# EAGLE design Serial I2C Bridge (EAGLE 6.1)
DATABASE: ./../../../eagle/PARTSDB.TXT
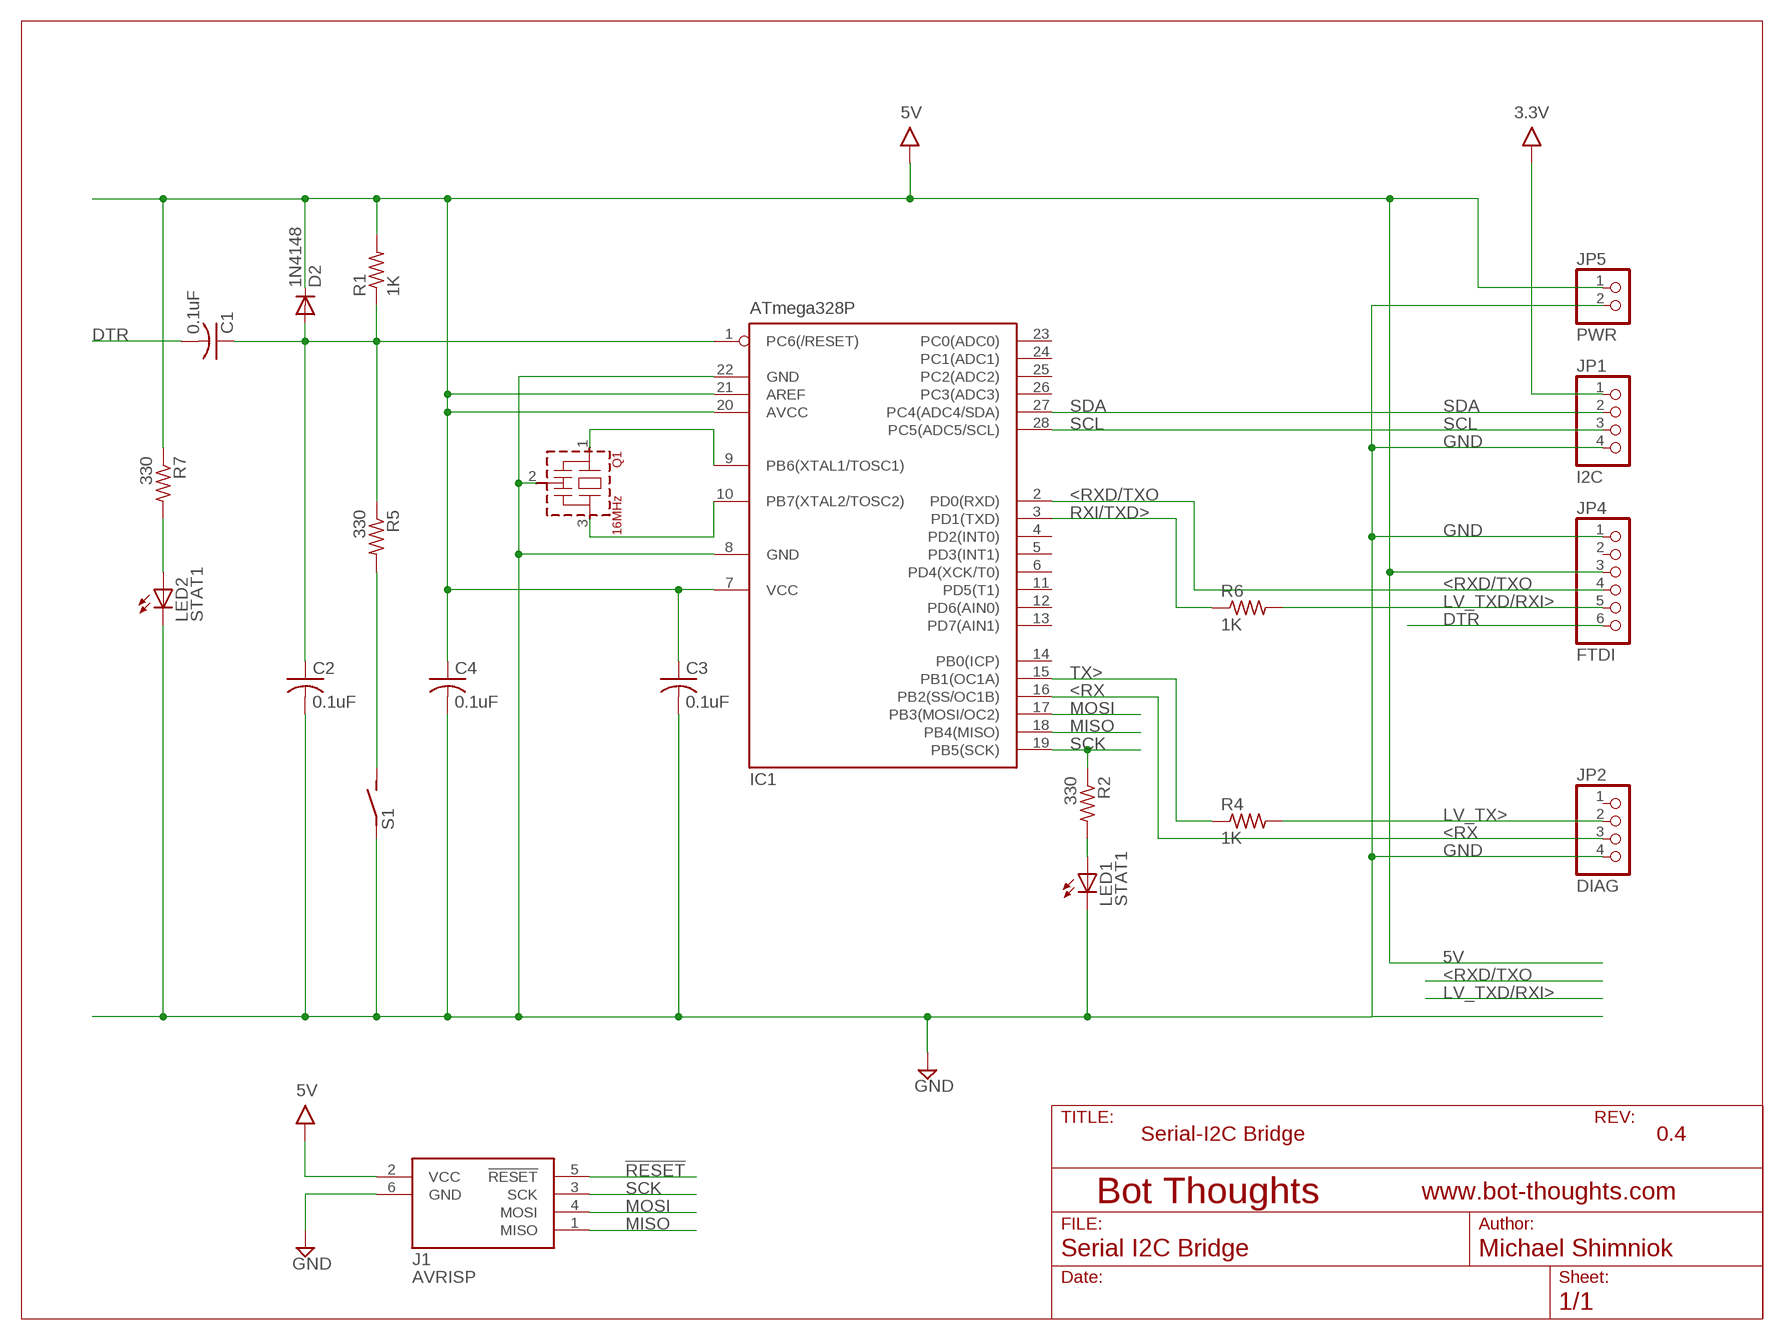
[diagram p0: schematic, sheet 1]

## Parts
C1  0.1uF  C-USC0805  [C0805]
C2  0.1uF  C-USC0805  [C0805]
C3  0.1uF  C-USC0805  [C0805]
C4  0.1uF  C-USC0805  [C0805]
D2  1N4148  1N4148DO35-7  [DO35-7]
IC1  ATmega328P  MEGA8-P  [DIL28-3]
J1  AVRISP  AVRISP6  [CON6P2R]
JP1  I2C  PINHD-1X04_2.54-S  [1X04-S]
JP2  DIAG  PINHD-1X04_2.54-S  [1X04-S]
JP4  FTDI  PINHD-1X06_2.54-S  [1X06-S]
JP5  PWR  PINHD-1X02_2.54-S  [1X02-S]
LED1  STAT1  LED3MM  [LED3MM]
LED2  STAT1  LED3MM  [LED3MM]
Q1  16MHz  CSTLS_G*  [CSTLS_G9]
R1  1K  R-US_0204/5  [0204/5]
R2  330  R-US_0204/5  [0204/5]
R4  1K  R-US_0204/5  [0204/5]
R5  330  R-US_0204/5  [0204/5]
R6  1K  R-US_0204/5  [0204/5]
R7  330  R-US_0204/5  [0204/5]
S1  RESET\  SPST2EVQ11X09  [EVQ11X09]

## Nets
3.3V: JP1.1
5V: C3.1 C4.1 D2.C IC1.7(VCC) IC1.20(AVCC) IC1.21(AREF) J1.2(VCC) JP4.3 JP5.1 R1.2 R7.1
!RESET: C1.1 C2.1 D2.A IC1.1(PC6(/RESET)) J1.5(!RESET) R1.1 R5.1
<RX: IC1.16(PB2(SS/OC1B)) JP2.3
<RXD/TXO: IC1.2(PD0(RXD)) JP4.4
DTR: C1.2 JP4.6
GND: C2.2 C3.2 C4.2 IC1.8(GND) IC1.22(GND) J1.6(GND) JP1.4 JP2.4 JP4.1 JP5.2 LED1.K(C) LED2.K(C) Q1.2(VSS) S1.1
LV_TX>: JP2.2 R4.2
LV_TXD/RXI>: JP4.5 R6.2
MISO: IC1.18(PB4(MISO)) J1.1(MISO)
MOSI: IC1.17(PB3(MOSI/OC2)) J1.4(MOSI)
N$2: IC1.9(PB6(XTAL1/TOSC1)) Q1.1
N$3: IC1.10(PB7(XTAL2/TOSC2)) Q1.3
N$4: LED1.A R2.2
N$7: R5.2 S1.2
N$8: LED2.A R7.2
RXI/TXD>: IC1.3(PD1(TXD)) R6.1
SCK: IC1.19(PB5(SCK)) J1.3(SCK) R2.1
SCL: IC1.28(PC5(ADC5/SCL)) JP1.3
SDA: IC1.27(PC4(ADC4/SDA)) JP1.2
TX>: IC1.15(PB1(OC1A)) R4.1
Unconnected: IC1.4(PD2(INT0)) IC1.5(PD3(INT1)) IC1.6(PD4(XCK/T0)) IC1.11(PD5(T1)) IC1.12(PD6(AIN0)) IC1.13(PD7(AIN1)) IC1.14(PB0(ICP)) IC1.23(PC0(ADC0)) IC1.24(PC1(ADC1)) IC1.25(PC2(ADC2)) IC1.26(PC3(ADC3)) JP2.1 JP4.2

## Notes on the sheet
- Serial-I2C Bridge | 0.4

## Library data of the parts
C1 = rcl:C-US: CAPACITOR, American symbol; PARTNO: CC0603ZRY5V7BB104
C2-C4 = rcl:C-US: CAPACITOR, American symbol; PARTNO: C1608X5R0J105K
D2 = diode:1N4148: DIODE high speed (Philips)
IC1 = atmel:MEGA8-P: MICROCONTROLLER 8 Kbytes FLASH, 1 kbytes SRAM, 512 bytes EEPROM, USART, 4-channel 10 bit ADC, 2-channel 8 bit ADC Pin compatible with Atmega48, ATMega88, ATMega168 Source: avr.lbr; OC_FARNELL: unknown; OC_NEWARK: unknown; PARTNO: DEV-10524
J1 = ads4:AVRISP6: 6-pin dual-row connector for Atmel AVRISP programmer interface
JP1 JP2 = pinhead-2:PINHD-1X04: PIN HEADER; PARTNO: 2211S-04G
JP4 = pinhead-2:PINHD-1X06: PIN HEADER; PARTNO: 2211S-06G
JP5 = pinhead-2:PINHD-1X02: PIN HEADER
LED1 LED2 = led:LED: LED OSRAM: - CHIPLED LG R971, LG N971, LY N971, LG Q971, LY Q971, LO R971, LY R971 LH N974, LH R974 LS Q976, LO Q976, LY Q976 LO Q996 - Hyper CHIPLED LW Q18S LB Q993, LB Q99A, LB R99A - SideLED LS A670, LO A670, LY A670, LG A670, LP A670 LB A673, LV A673, LT A673, LW A673 LH A674 LY A675 LS A676, LA A676, LO A676, LY A676, LW A676 LS A679, LY A679, LG A679 - Hyper Micro SIDELED® LS Y876, LA Y876, LO Y876, LY Y876 LT Y87S - SmartLED LW L88C, LW L88S LB L89C, LB L89S, LG L890 LS L89K, LO L89K, LY L89K LS L896, LA L896, LO L896, LY L896 - TOPLED LS T670, LO T670, LY T670, LG T670, LP T670 LSG T670, LSP T670, LSY T670, LOP T670, LYG T670 LG T671, LOG T671, LSG T671 LB T673, LV T673, LT T673, LW T673 LH T674 LS T676, LA T676, LO T676, LY T676, LB T676, LH T676, LSB T676, LW T676 LB T67C, LV T67C, LT T67C, LS T67K, LO T67K, LY T67K, LW E67C LS E67B, LA E67B, LO E67B, LY E67B, LB E67C, LV E67C, LT E67C LW T67C LS T679, LY T679, LG T679 LS T770, LO T770, LY T770, LG T770, LP T770 LB T773, LV T773, LT T773, LW T773 LH T774 LS E675, LA E675, LY E675, LS T675 LS T776, LA T776, LO T776, LY T776, LB T776 LHGB T686 LT T68C, LB T68C - Hyper Mini TOPLED® LB M676 - Mini TOPLED Santana® LG M470 LS M47K, LO M47K, LY M47K Source: http://www.osram.convergy.de LUXEON: - LUMILED® LXK2-PW12-R00, LXK2-PW12-S00, LXK2-PW14-U00, LXK2-PW14-V00 LXK2-PM12-R00, LXK2-PM12-S00, LXK2-PM14-U00 LXK2-PE12-Q00, LXK2-PE12-R00, LXK2-PE12-S00, LXK2-PE14-T00, LXK2-PE14-U00 LXK2-PB12-K00, LXK2-PB12-L00, LXK2-PB12-M00, LXK2-PB14-N00, LXK2-PB14-P00, LXK2-PB14-Q00 LXK2-PR12-L00, LXK2-PR12-M00, LXK2-PR14-Q00, LXK2-PR14-R00 LXK2-PD12-Q00, LXK2-PD12-R00, LXK2-PD12-S00 LXK2-PH12-R00, LXK2-PH12-S00 LXK2-PL12-P00, LXK2-PL12-Q00, LXK2-PL12-R00 Source: www.luxeon.com KINGBRIGHT: KA-3528ASYC Source: www.kingbright.com; BOM: EXCLUDE
Q1 = murata-resonators:CSTLS_G: Ceramic resonator 2.00 to 10.00 MHz; PARTNO: AWCR-16.00MD
R1 = rcl:R-US_: RESISTOR, American symbol; BOM: EXCLUDE
R2 R4-R7 = rcl:R-US_: RESISTOR, American symbol; PARTNO: CRCW0603330RJNEA
S1 = ads4:SPST2: SPST Switch; PARTNO: SALVAGE

## Board
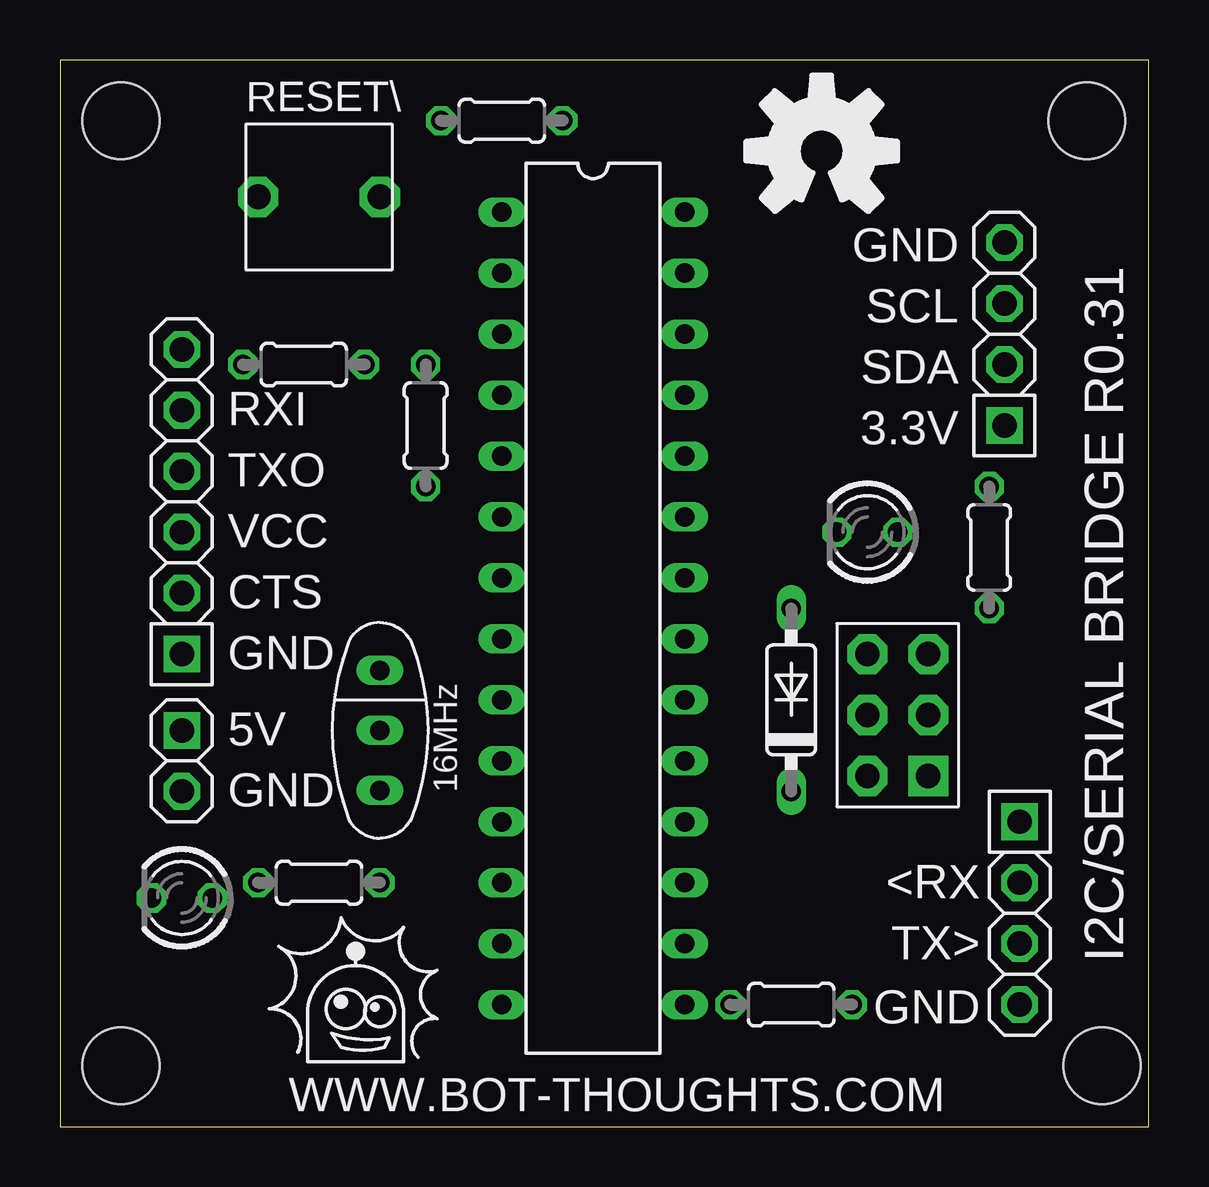
[diagram p1: board, top side]
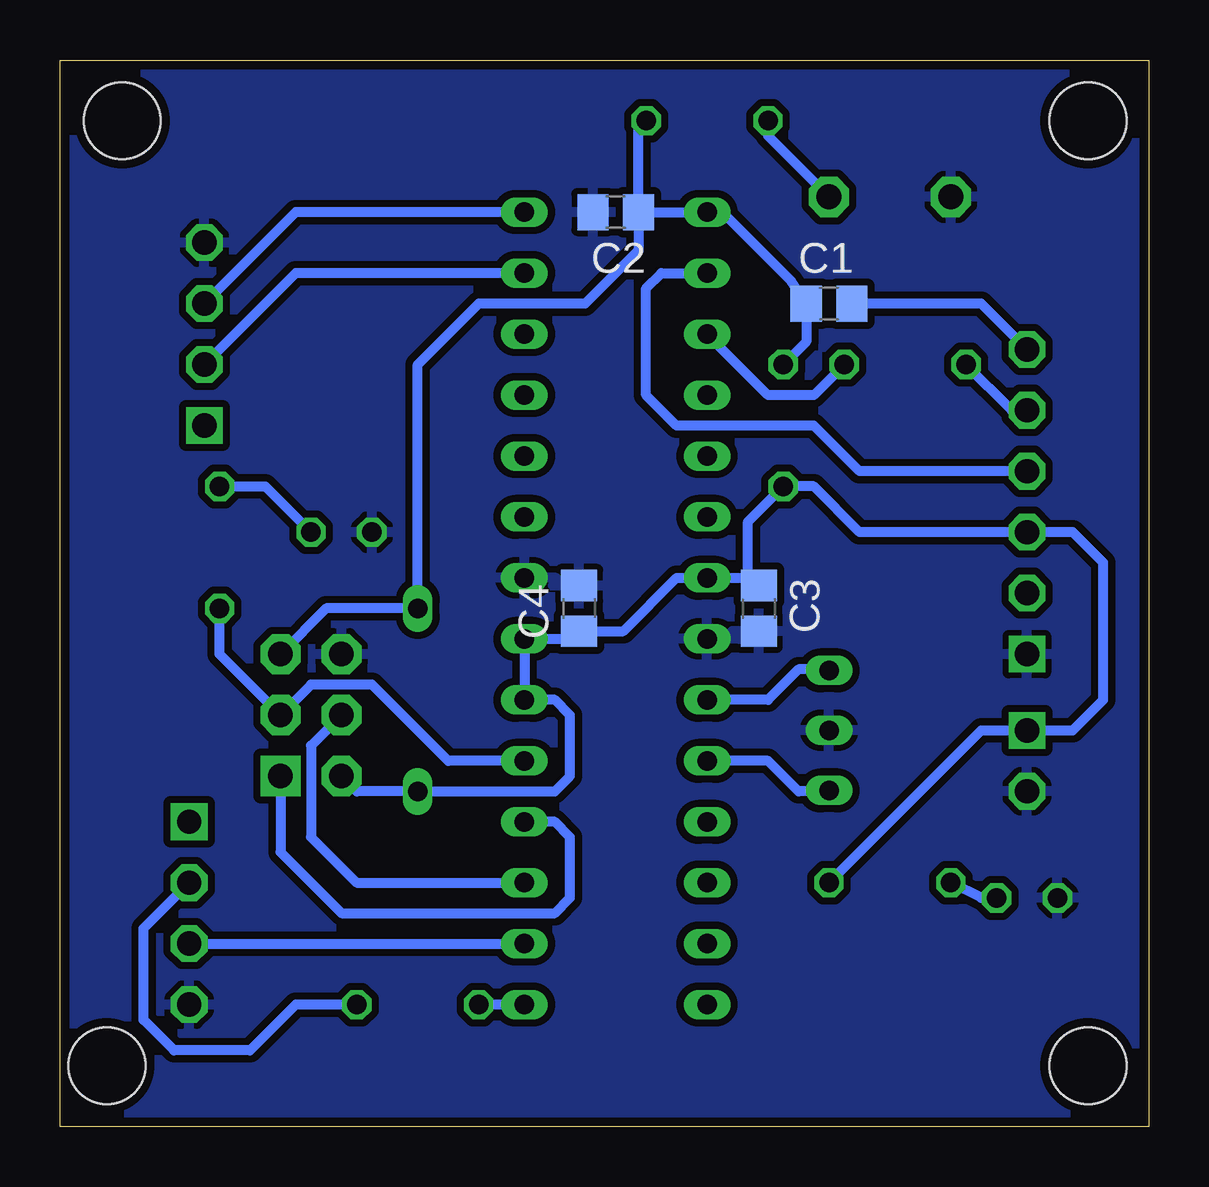
[diagram p2: board, bottom side, seen from below]

Size 45.39 x 44.44 mm. Coordinates in mm from the lower left corner, seen from the top.
Outline: 0,0 45.39,0 45.39,44.44 0,44.44 0,0
Copper layers (1*16): Top 0.0356mm / dielectric 1.5011mm / Bottom 0.0356mm
Design rules: minimum track width 6mil, minimum drill 13mil, track to track 6mil, track to pad 6mil, pad to pad 6mil, via to via 6mil, smd to smd 6mil, copper to edge 15mil, drill to drill 6mil, minimum pad ring 7mil, minimum via ring 7mil, stop-mask expansion 4mil, vias tented up to drill 0mil, thermal gap 10mil
Holes 3.2 mm at 2.54,41.91 42.8,41.91 43.43,2.54 2.54,2.54

### Footprints (pad centres in the part's own frame; a part is rotated, then mirrored left to right if it is on the bottom)
C0805 = smd 1.3 x 1.5: 1 -0.95,0; 2 0.95,0
DO35-7 = drill 0.813 long: A 3.81,0; C -3.81,0
DIL28-3 = drill 0.813 long: 1 -16.51,-3.81; 2 -13.97,-3.81; 3 -11.43,-3.81; 4 -8.89,-3.81; 5 -6.35,-3.81; 6 -3.81,-3.81; 7 -1.27,-3.81; 8 1.27,-3.81; 9 3.81,-3.81; 10 6.35,-3.81; 11 8.89,-3.81; 12 11.43,-3.81; 13 13.97,-3.81; 14 16.51,-3.81; 15 16.51,3.81; 16 13.97,3.81; 17 11.43,3.81; 18 8.89,3.81; 19 6.35,3.81; 20 3.81,3.81; 21 1.27,3.81; 22 -1.27,3.81; 23 -3.81,3.81; 24 -6.35,3.81; 25 -8.89,3.81; 26 -11.43,3.81; 27 -13.97,3.81; 28 -16.51,3.81
CON6P2R = drill 1.016 pad 1.676 square: 1 -2.54,-1.27 | drill 1.016 pad 1.676 octagon: 2 -2.54,1.27; 3 0,-1.27; 4 0,1.27; 5 2.54,-1.27; 6 2.54,1.27
1X04-S = drill 1.016 square: 1 -3.81,0 | drill 1.016 octagon: 2 -1.27,0; 3 1.27,0; 4 3.81,0
1X06-S = drill 1.016 square: 1 -6.35,0 | drill 1.016 octagon: 2 -3.81,0; 3 -1.27,0; 4 1.27,0; 5 3.81,0; 6 6.35,0
1X02-S = drill 1.016 square: 1 -1.27,0 | drill 1.016 octagon: 2 1.27,0
LED3MM = drill 0.813 octagon: A -1.27,0; K 1.27,0
CSTLS_G9 = drill 0.813 long: 1 -2.5,0; 2 0,0; 3 2.5,0
0204/5 = drill 0.813 octagon: 1 -2.54,0; 2 2.54,0
EVQ11X09 = drill 1.041 pad 1.676 octagon: 1 0,0; 2 5.08,0

### Placement (x,y rotation side)
C1  13.34,34.29 0 bottom
C2  22.23,38.1 180 bottom
C3  16.26,21.59 270 bottom
C4  23.75,21.59 90 bottom
D2  30.48,17.78 90 top
IC1  22.23,21.59 270 top
J1  34.92,17.14 90 top
JP1  39.37,33.02 90 top
JP2  40.01,8.89 270 top
JP4  5.08,26.04 90 top
JP5  5.08,15.24 270 top
LED1  33.66,24.77 180 top
LED2  5.08,9.53 180 top
Q1  13.34,16.51 270 top
R1  15.24,29.21 270 top
R2  38.73,24.13 90 top
R4  30.48,5.08 0 top
R5  18.41,41.91 180 top
R6  10.16,31.75 180 top
R7  10.79,10.16 180 top
S1  8.26,38.73 0 top

### Tracks (layer width: path | path; a pad name or v marks a point on that pad's centre or on a via)
5V
  Bottom 0.406: 16.7,22.86 IC1.7 19.68,22.86 21.91,20.64 C4.1 24.07,20.32 IC1.21 IC1.20 24.77,17.78 24.13,17.14 24.13,14.61 24.77,13.97 D2.C 33.02,13.97 J1.2 | 16.7,22.86 C3.1 | R7.1 6.99,16.51 JP5.1 3.17,16.51 1.91,17.78 1.91,23.5 3.17,24.77 JP4.3 12.06,24.77 13.97,26.67 R1.2 16.7,25.21 16.7,22.86
!RESET
  Bottom 0.406: R1.1 14.29,32.7 C1.1 14.92,35.24 17.78,38.1 IC1.1 C2.1 | C2.1 21.27,41.59 R5.1 | J1.5 34.29,21.59 D2.A 30.48,31.75 27.94,34.29 23.5,34.29 21.27,36.51 C2.1
<RX
  Bottom 0.406: JP2.3 IC1.16
<RXD/TXO
  Bottom 0.406: JP4.4 12.06,27.3 13.97,29.21 19.68,29.21 20.95,30.48 20.95,34.92 20.32,35.56 IC1.2
DTR
  Bottom 0.406: JP4.6 6.99,34.29 C1.2
GND
  pour Bottom (isolate 0.305): 0,44.45 45.72,44.45 45.72,0 0,0
LV_TX>
  Bottom 0.406: JP2.2 41.91,8.26 41.91,4.45 40.64,3.17 37.47,3.17 35.56,5.08 R4.2
LV_TXD/RXI>
  Bottom 0.406: JP4.5 5.71,29.84 R6.2
MISO
  Bottom 0.406: J1.1 36.2,11.43 33.66,8.89 24.77,8.89 24.13,9.53 24.13,12.06 24.77,12.7 IC1.18
MOSI
  Bottom 0.406: J1.4 34.92,15.88 34.92,12.06 33.02,10.16 IC1.17
N$2
  Bottom 0.406: IC1.9 15.88,17.78 14.61,19.05 14.01,19.05 Q1.1
N$3
  Bottom 0.406: IC1.10 15.88,15.24 14.61,13.97 13.93,13.97 Q1.3
N$4
  Bottom 0.406: R2.2 36.83,26.67 LED1.A
N$7
  Bottom 0.406: S1.2 15.88,41.27 R5.2
N$8
  Bottom 0.406: LED2.A 6.99,9.53 R7.2
RXI/TXD>
  Bottom 0.406: R6.1 13.97,30.48 15.88,30.48 IC1.3
SCK
  Bottom 0.406: IC1.19 29.21,15.24 32.38,18.41 34.92,18.41 J1.3 38.73,19.68 R2.1
SCL
  Bottom 0.406: IC1.28 35.56,38.1 JP1.3
SDA
  Bottom 0.406: IC1.27 35.56,35.56 JP1.2
TX>
  Bottom 0.406: IC1.15 R4.1

### Text on the board
tNames: GND | SCL | SDA | 3.3V | RXI | TXO | VCC | CTS | GND | 5V | GND | <RX | TX> | I2C/SERIAL BRIDGE R0.31 | GND | WWW.BOT-THOUGHTS.COM